# Altium schematic sheet SDP_1.SchDoc
size 420 x 297 mm; PageSetup: Record=PageOptions|CenterHorizontal=False|CenterVertical=False|PrintScale=0.95|XCorrection=0.00|YCorrection=0.00|PrintKind=1|BorderSize=5000000|LeftOffset=0|BottomOffset=0|Orientation=1|PaperLength=1000|PaperWidth=1000|Scale=100|PaperSource=15|PrintQuality=600|MediaType=1|DitherType=10|PaperKind=A4|PrintScaleMode=1
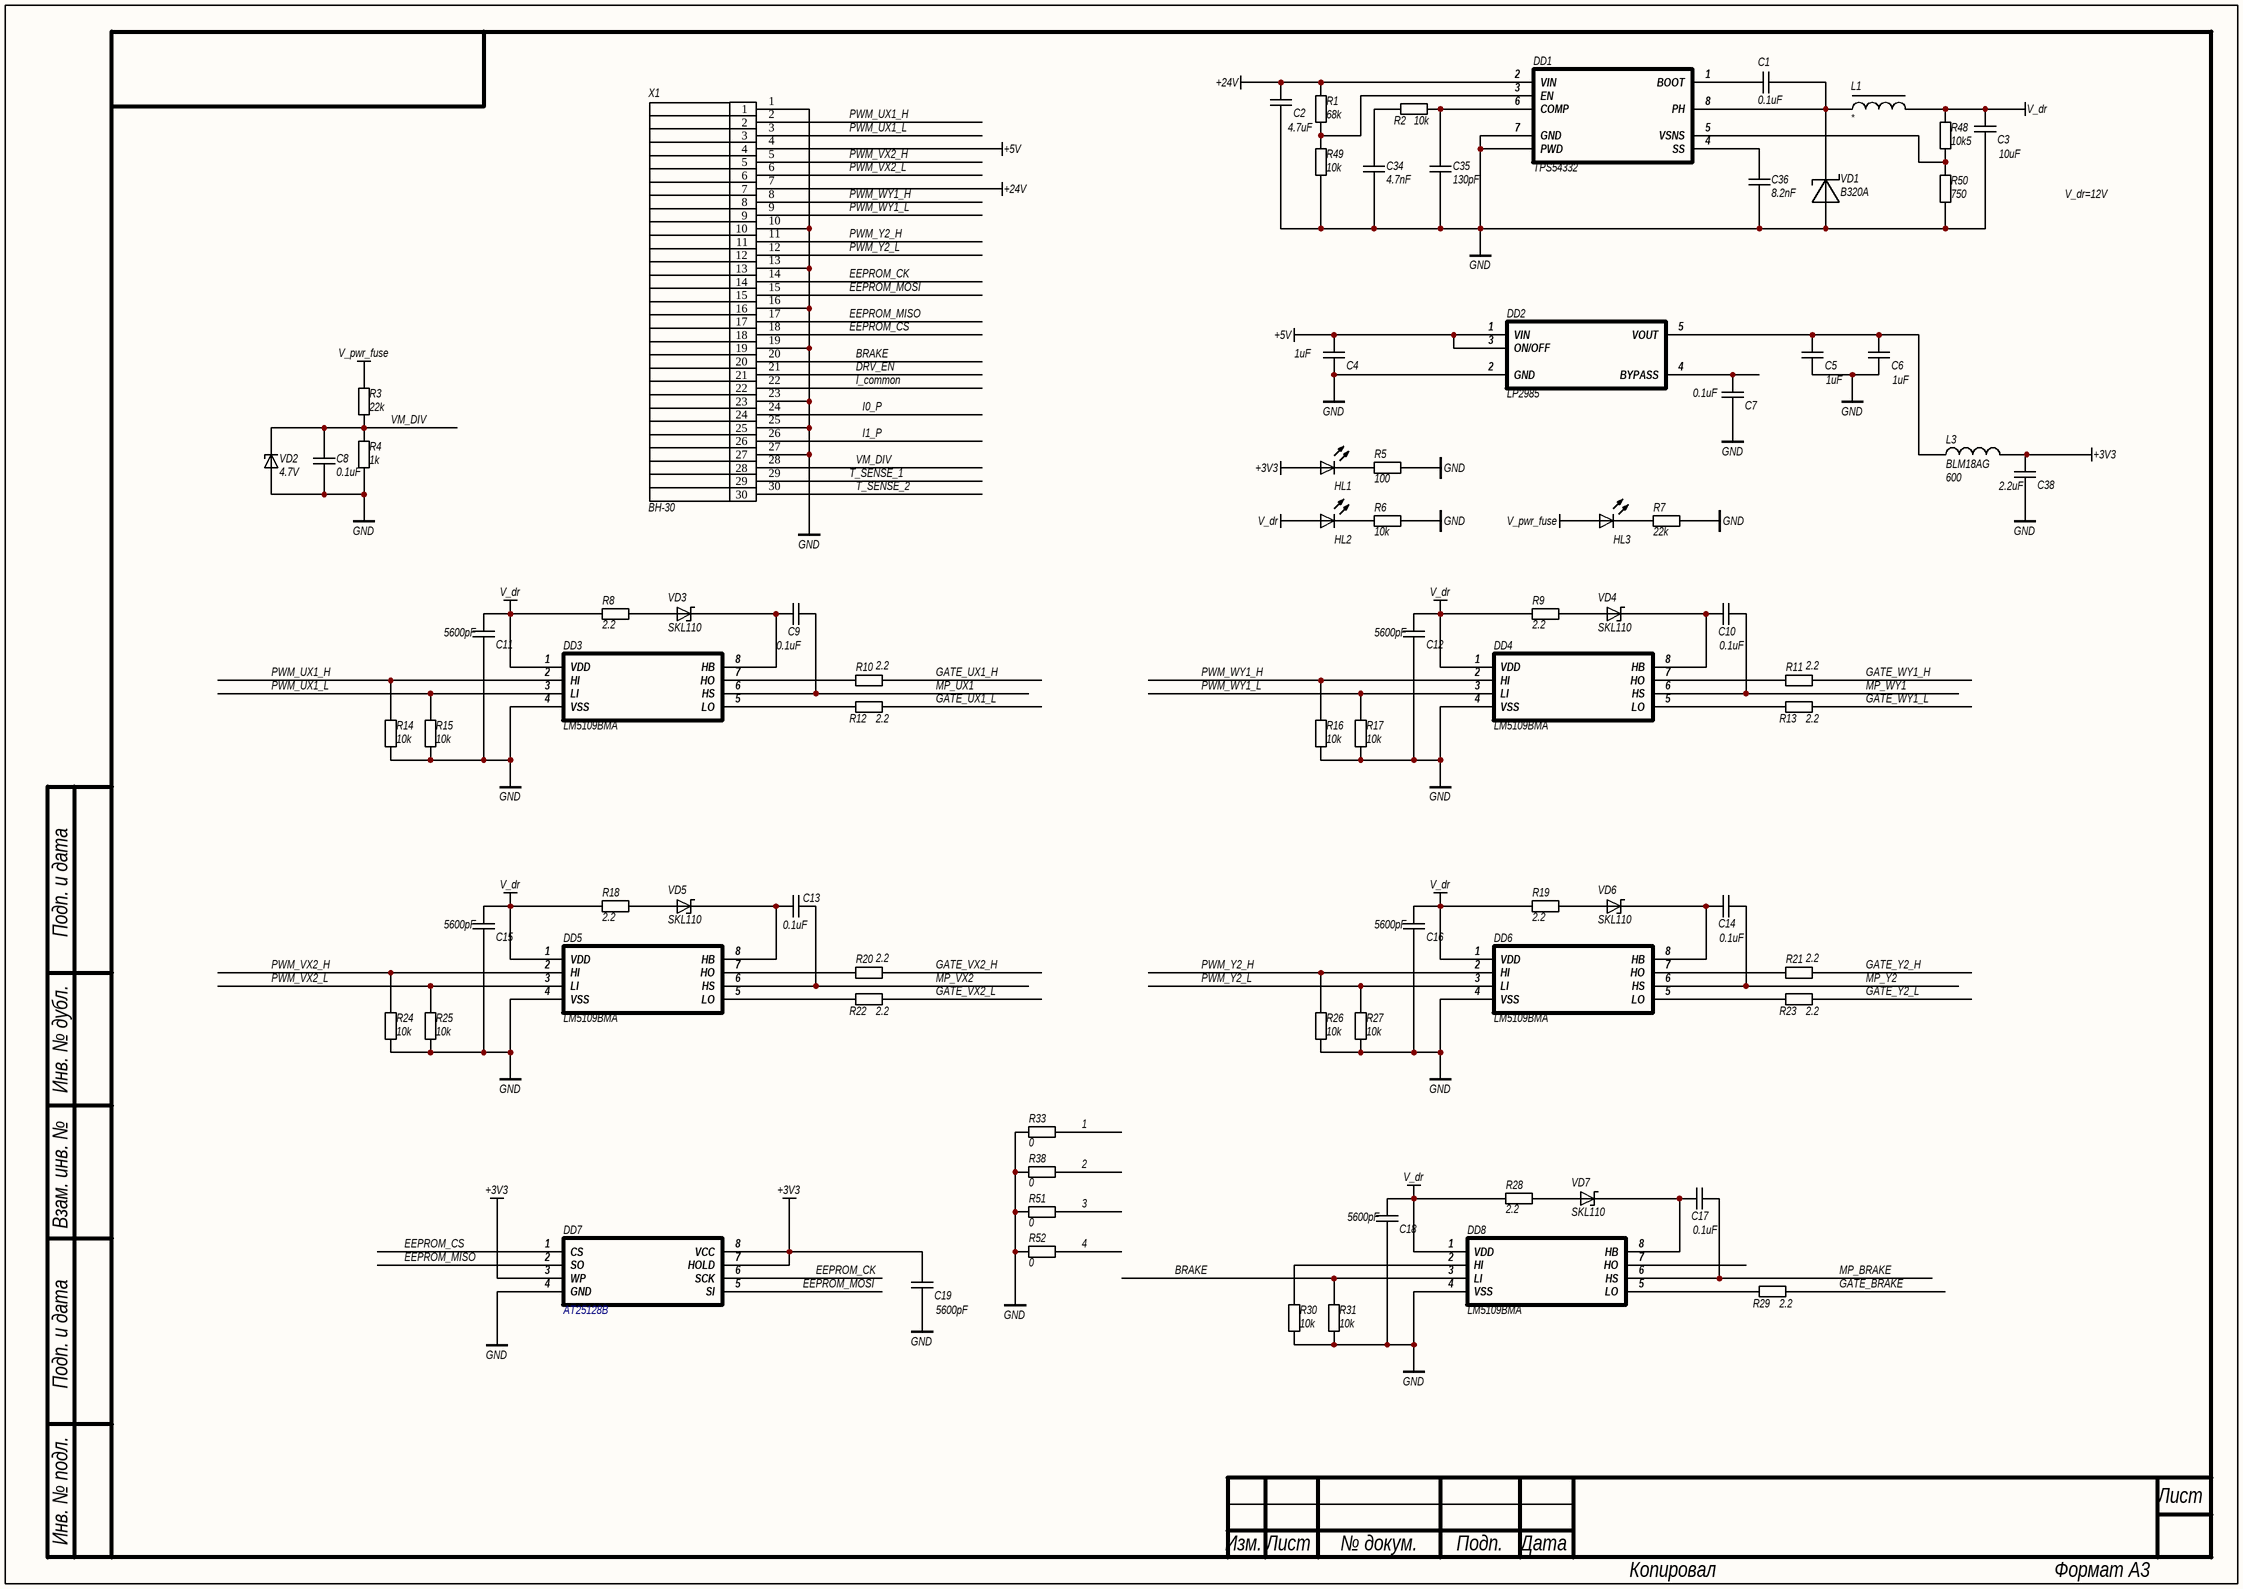
[diagram p0: SDP_1.SchDoc]

## Parts
C1  value 0.1uF  [C0603]  (hidden comment: CAP)
C2  value 4.7uF  [C1210]  (hidden comment: CAP)
C3  value 10uF  [C1210]  (hidden comment: CAP)
C4  value 1uF  [C0603]  (hidden comment: CAP)
C5  value 1uF  [C0603]  (hidden comment: CAP)
C6  value 1uF  [C0603]  (hidden comment: CAP)
C7  value 0.1uF  [C0603]  (hidden comment: CAP)
C8  value 0.1uF  [C0603]  (hidden comment: CAP)
C9  value 0.1uF  [C0603]  (hidden comment: CAP)
C10  value 0.1uF  [C0603]  (hidden comment: CAP)
C11  value 5600pF  [C0603]  (hidden comment: CAP)
C12  value 5600pF  [C0603]  (hidden comment: CAP)
C13  value 0.1uF  [C0603]  (hidden comment: CAP)
C14  value 0.1uF  [C0603]  (hidden comment: CAP)
C15  value 5600pF  [C0603]  (hidden comment: CAP)
C16  value 5600pF  [C0603]  (hidden comment: CAP)
C17  value 0.1uF  [C0603]  (hidden comment: CAP)
C18  value 5600pF  [C0603]  (hidden comment: CAP)
C19  value 5600pF  [C0603]  (hidden comment: CAP)
C34  value 4.7nF  [C0603]  (hidden comment: CAP)
C35  value 130pF  [C0603]  (hidden comment: CAP)
C36  value 8.2nF  [C0603]  (hidden comment: CAP)
C38  value 2.2uF  [C0603]  (hidden comment: CAP)
DD1  TPS54332  [DDA]
DD2  LP2985  [SOT23-5]
DD3  LM5109BMA  [SO8_L]
DD4  LM5109BMA  [SO8_L]
DD5  LM5109BMA  [SO8_L]
DD6  LM5109BMA  [SO8_L]
DD7  AT25128B  [SO8_L]
DD8  LM5109BMA  [SO8_L]
HL1  LED0603  [LED0603]  (value not drawn)
HL2  LED0603  [LED0603]  (value not drawn)
HL3  LED0603  [LED0603]  (value not drawn)
L1  XAL5050  [XAL5050]  (value not drawn)
L3  BLM18AG  value 600  [R0603]
R1  value 68k  [R0603]  (hidden comment: RES)
R2  value 10k  [R0603]  (hidden comment: RES)
R3  value 22k  [R0603]  (hidden comment: RES)
R4  value 1k  [R0603]  (hidden comment: RES)
R5  value 100  [R0603]  (hidden comment: RES)
R6  value 10k  [R0603]  (hidden comment: RES)
R7  value 22k  [R0603]  (hidden comment: RES)
R8  value 2.2  [R0603]  (hidden comment: RES)
R9  value 2.2  [R0603]  (hidden comment: RES)
R10  value 2.2  [R0603]  (hidden comment: RES)
R11  value 2.2  [R0603]  (hidden comment: RES)
R12  value 2.2  [R0603]  (hidden comment: RES)
R13  value 2.2  [R0603]  (hidden comment: RES)
R14  value 10k  [R0603]  (hidden comment: RES)
R15  value 10k  [R0603]  (hidden comment: RES)
R16  value 10k  [R0603]  (hidden comment: RES)
R17  value 10k  [R0603]  (hidden comment: RES)
R18  value 2.2  [R0603]  (hidden comment: RES)
R19  value 2.2  [R0603]  (hidden comment: RES)
R20  value 2.2  [R0603]  (hidden comment: RES)
R21  value 2.2  [R0603]  (hidden comment: RES)
R22  value 2.2  [R0603]  (hidden comment: RES)
R23  value 2.2  [R0603]  (hidden comment: RES)
R24  value 10k  [R0603]  (hidden comment: RES)
R25  value 10k  [R0603]  (hidden comment: RES)
R26  value 10k  [R0603]  (hidden comment: RES)
R27  value 10k  [R0603]  (hidden comment: RES)
R28  value 2.2  [R0603]  (hidden comment: RES)
R29  value 2.2  [R0603]  (hidden comment: RES)
R30  value 10k  [R0603]  (hidden comment: RES)
R31  value 10k  [R0603]  (hidden comment: RES)
R33  value 0  [R0603]  (hidden comment: RES)
R38  value 0  [R0603]  (hidden comment: RES)
R48  value 10k5  [R0603]  (hidden comment: RES)
R49  value 10k  [R0603]  (hidden comment: RES)
R50  value 750  [R0603]  (hidden comment: RES)
R51  value 0  [R0603]  (hidden comment: RES)
R52  value 0  [R0603]  (hidden comment: RES)
VD1  B320A  [SMA-DO214]
VD2  Voltage: 4.7V  [SOD323]  (hidden comment: BZX384)
VD3  SKL110  [SOD-123]
VD4  SKL110  [SOD-123]
VD5  SKL110  [SOD-123]
VD6  SKL110  [SOD-123]
VD7  SKL110  [SOD-123]
X1  BH-30  [IDC-30(BH-30)]

## Nets
+3V3: C19.2 C38.2 DD7.3(WP) DD7.7(HOLD) DD7.8(VCC) HL1.1(A) L3.2
+5V: C4.2 DD2.1(VIN) DD2.3(ON/OFF) X1.4
+24V: C2.2 DD1.2(VIN) R1.2 X1.7
GND: C2.1 C3.1 C4.1 C5.1 C6.1 C7.1 C8.1 C11.1 C12.1 C15.1 C16.1 C18.1 C19.1 C34.1 C35.1 C36.1 C38.1 DD1.7(GND) DD1.9(PWD) DD2.2(GND) DD3.4(VSS) DD4.4(VSS) DD5.4(VSS) DD6.4(VSS) DD7.4(GND) DD8.4(VSS) R4.1 R5.1 R6.1 R7.1 R14.1 R15.1 R16.1 R17.1 R24.1 R25.1 R26.1 R27.1 R30.1 R31.1 R33.2 R38.2 R49.1 R50.1 R51.2 R52.2 VD1.1(A) VD2.1(A) X1.1 X1.10 X1.13 X1.16 X1.19 X1.23 X1.25 X1.27
V_dr: C3.2 C11.2 C12.2 C15.2 C16.2 C18.2 DD3.1(VDD) DD4.1(VDD) DD5.1(VDD) DD6.1(VDD) DD8.1(VDD) HL2.1(A) L1.2 R8.1 R9.1 R18.1 R19.1 R28.1 R48.2
V_pwr_fuse: HL3.1(A) R3.2
1: R33.1
2: R38.1
3: R51.1
4: R52.1
BRAKE: DD8.3(LI) R31.2 X1.20
DRV_EN: X1.21
EEPROM_CK: DD7.6(SCK) X1.14
EEPROM_CS: DD7.1(CS) X1.18
EEPROM_MISO: DD7.2(SO) X1.17
EEPROM_MOSI: DD7.5(SI) X1.15
GATE_BRAKE: R29.2
GATE_UX1_H: R10.2
GATE_UX1_L: R12.2
GATE_VX2_H: R20.2
GATE_VX2_L: R22.2
GATE_WY1_H: R11.2
GATE_WY1_L: R13.2
GATE_Y2_H: R21.2
GATE_Y2_L: R23.2
I0_P: X1.24
I1_P: X1.26
I_common: X1.22
MP_BRAKE: C17.2 DD8.6(HS)
MP_UX1: C9.2 DD3.6(HS)
MP_VX2: C13.2 DD5.6(HS)
MP_WY1: C10.2 DD4.6(HS)
MP_Y2: C14.2 DD6.6(HS)
PWM_UX1_H: DD3.2(HI) R14.2 X1.2
PWM_UX1_L: DD3.3(LI) R15.2 X1.3
PWM_VX2_H: DD5.2(HI) R24.2 X1.5
PWM_VX2_L: DD5.3(LI) R25.2 X1.6
PWM_WY1_H: DD4.2(HI) R16.2 X1.8
PWM_WY1_L: DD4.3(LI) R17.2 X1.9
PWM_Y2_H: DD6.2(HI) R26.2 X1.11
PWM_Y2_L: DD6.3(LI) R27.2 X1.12
T_SENSE_1: X1.29
T_SENSE_2: X1.30
VM_DIV: C8.2 R3.1 R4.2 VD2.2(K) X1.28
NetC1_1: C1.1 DD1.8(PH) L1.1 VD1.2(K)
NetC1_2: C1.2 DD1.1(BOOT)
NetC5_2: C5.2 C6.2 DD2.5(VOUT) L3.1
NetC7_2: C7.2 DD2.4(BYPASS)
NetC9_1: C9.1 DD3.8(HB) VD3.2(K)
NetC10_1: C10.1 DD4.8(HB) VD4.2(K)
NetC13_1: C13.1 DD5.8(HB) VD5.2(K)
NetC14_1: C14.1 DD6.8(HB) VD6.2(K)
NetC17_1: C17.1 DD8.8(HB) VD7.2(K)
NetC34_2: C34.2 R2.2
NetC35_2: C35.2 DD1.6(COMP) R2.1
NetC36_2: C36.2 DD1.4(SS)
NetDD1_3: DD1.3(EN) R1.1 R49.2
NetDD1_5: DD1.5(VSNS) R48.1 R50.2
NetDD3_5: DD3.5(LO) R12.1
NetDD3_7: DD3.7(HO) R10.1
NetDD4_5: DD4.5(LO) R13.1
NetDD4_7: DD4.7(HO) R11.1
NetDD5_5: DD5.5(LO) R22.1
NetDD5_7: DD5.7(HO) R20.1
NetDD6_5: DD6.5(LO) R23.1
NetDD6_7: DD6.7(HO) R21.1
NetDD8_2: DD8.2(HI) R30.2
NetDD8_5: DD8.5(LO) R29.1
NetHL1_2: HL1.2(K) R5.2
NetHL2_2: HL2.2(K) R6.2
NetHL3_2: HL3.2(K) R7.2
NetR8_2: R8.2 VD3.1(A)
NetR9_2: R9.2 VD4.1(A)
NetR18_2: R18.2 VD5.1(A)
NetR19_2: R19.2 VD6.1(A)
NetR28_2: R28.2 VD7.1(A)

Not connected (* = marked no-connect by the designer): DD8 7(HO)

## Notes on the sheet
- V_dr=12V
- Подп. и дата
- Инв. № дубл.
- Взам. инв. №
- Инв. № подл.
- Лист
- Изм.
- № докум.
- Подп.
- Дата
- Копировал
- Формат А3

## Library data of the parts
C1 C2 C4-C19 C34-C36 = CAP: SMD Capacitor; Manufacturer: Murata; Material: X7R; Tolerance: 10%; Voltage: 50V; Type: Ceramic Capacitor
C3 = CAP: SMD Capacitor; Manufacturer: Murata; Material: X7R; Tolerance: 10%; Voltage: 25V; Type: Ceramic Capacitor
C38 = CAP: SMD Capacitor; Manufacturer: Murata; Material: X7R; Tolerance: 10%; Voltage: 10V; Type: Ceramic Capacitor
DD2 = LP2985-33DBV: Regulator
DD3-DD6 DD8 = LM5109BMA: Gate driver
DD7 = AT25128B-SSHL: EEPROM
L1 = XAL5050: chip inductor; value: *
R1-R31 R33 R38 R48-R52 = RES: SMD Resistor; Name: Chip SMD Resistor; Power: 0.062 Wt; Tolerance: 5%; Temperature Range: -55…155°C
VD1 = B320A: Shottky diode
VD3-VD7 = SKL110: Shottky rectifier
X1 = IDC15x2_GOST